# EAGLE design BUDDY_BEST (1) (EAGLE 9.6.2)
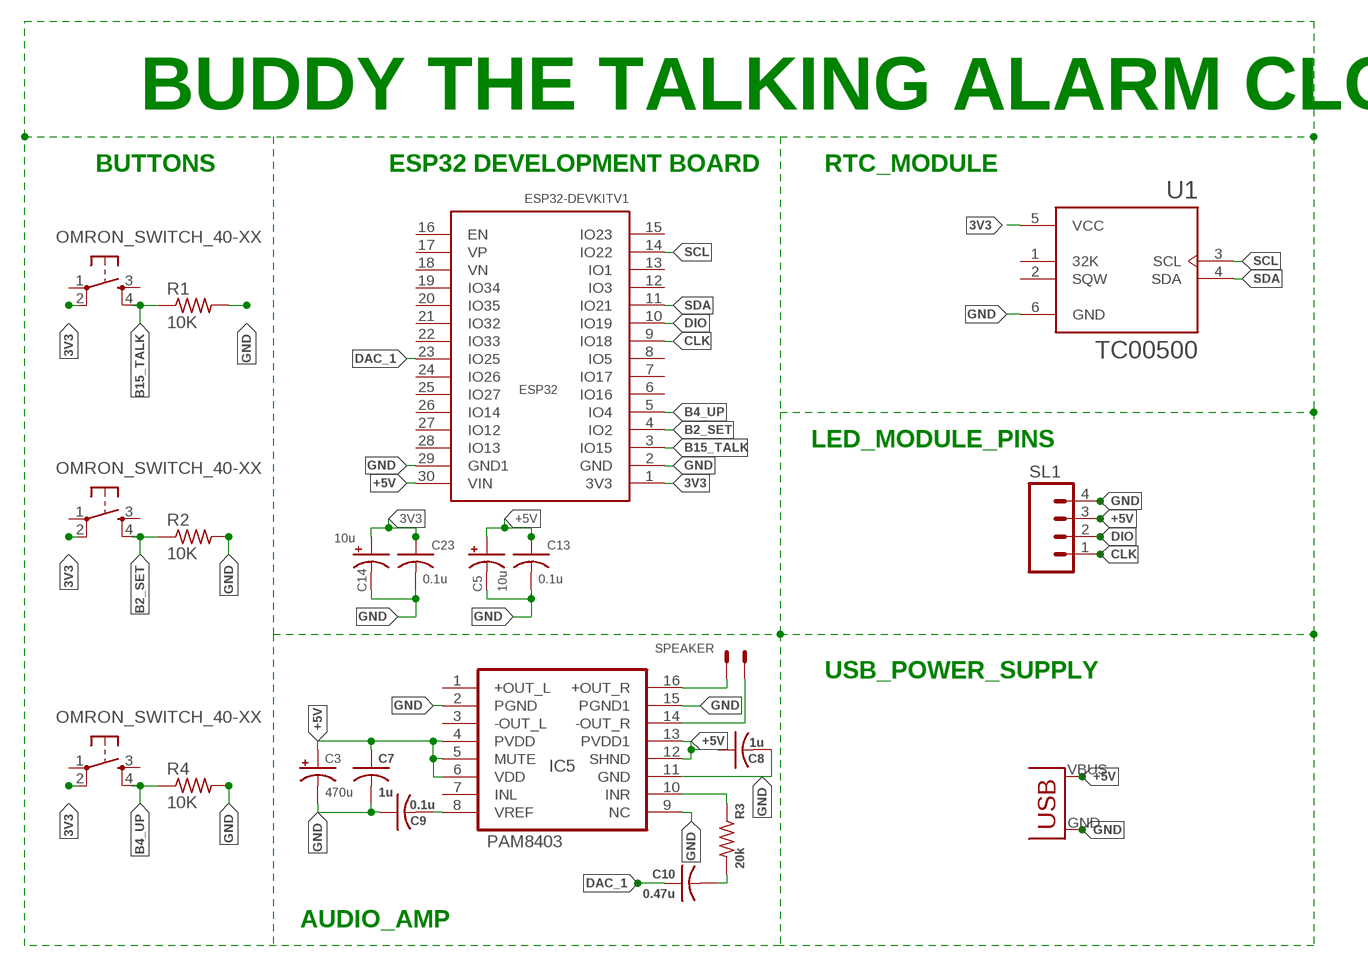
[diagram p0: schematic, sheet 1]

## Parts
C3  470u  CPOL-USE5-10.5  [E5-10,5]
C5  10u  CPOL-USE2.5-5  [E2,5-5]
C7  1u  CAP0805  [C0805]
C8  1u  CAP0805  [C0805]
C9  0.1u  CAP0805  [C0805]
C10  0.47u  CAP0603  [C0603]
C13  0.1u  C-US025-024X044  [C025-024X044]
C14  10u  CPOL-USE2.5-5  [E2,5-5]
C23  0.1u  C-US025-024X044  [C025-024X044]
ESP32  ESP32-DEVKITV1_ESP32DEVKITV1ESP32  [ESP32]
IC5  PAM8403  [SOP-16]
R1  10K  RESISTOR0207/10  [0207/10]
R2  10K  RESISTOR0207/10  [0207/10]
R3  20k  R-US_0207/10  [0207/10]
R4  10K  RESISTOR0207/10  [0207/10]
SL1  M04  [04P]
SPEAKER  SPEAKER  JST-XH-02-PIN-LONG-PAD  [JST-XH-02-PACKAGE-LONG-PAD]
U1  TC00500  [MODULE_TC00500]
U$1  OMRON_SWITCH_40-XX  [B3F-40XX]
U$2  OMRON_SWITCH_40-XX  [B3F-40XX]
U$3  OMRON_SWITCH_40-XX  [B3F-40XX]
U$5  USB(POWER)  [USB(POWER)]

## Nets
3V3: C14.+ C23.1 ESP32.1(3V3) U1.5(VCC) U$1.2(P1) U$2.2(P1) U$3.2(P1)
+5V [POWER]: C3.+ C5.+ C7.1 C8.1 C13.1 ESP32.30(VIN) IC5.4(PVDD) IC5.5(MUTE) IC5.6(VDD) IC5.12(SHND) IC5.13(PVDD1) SL1.3 U$5.VBUS(VCC)
B2_SET: ESP32.4(IO2) R2.1 U$1.4(S1)
B4_UP: ESP32.5(IO4) R4.1 U$3.4(S1)
B15_TALK: ESP32.3(IO15) R1.1 U$2.4(S1)
CLK: ESP32.9(IO18) SL1.1
DAC_1: C10.1 ESP32.23(IO25)
DIO: ESP32.10(IO19) SL1.2
GND: C3.- C5.- C7.2 C8.2 C9.1 C13.2 C14.- C23.2 ESP32.2(GND) ESP32.29(GND1) IC5.2(PGND) IC5.9(NC) IC5.11(GND) IC5.15(PGND1) R1.2 R2.2 R4.2 SL1.4 U1.6(GND) U$5.GND
N$1: IC5.16(+OUT_R) SPEAKER.2
N$5: IC5.14(-OUT_R) SPEAKER.1
N$7: C9.2 IC5.8(VREF)
N$8: C10.2 R3.2
N$29: IC5.10(INR) R3.1
SCL: ESP32.14(IO22) U1.3(SCL)
SDA: ESP32.11(IO21) U1.4(SDA)
Unconnected: ESP32.6(IO16) ESP32.7(IO17) ESP32.8(IO5) ESP32.12(IO3) ESP32.13(IO1) ESP32.15(IO23) ESP32.16(EN) ESP32.17(VP) ESP32.18(VN) ESP32.19(IO34) ESP32.20(IO35) ESP32.21(IO32) ESP32.22(IO33) ESP32.24(IO26) ESP32.25(IO27) ESP32.26(IO14) ESP32.27(IO12) ESP32.28(IO13) IC5.1(+OUT_L) IC5.3(-OUT_L) IC5.7(INL) U1.1(32K) U1.2(SQW) U$1.1(P) U$1.3(S) U$2.1(P) U$2.3(S) U$3.1(P) U$3.3(S)

## Notes on the sheet
- BUDDY THE TALKING ALARM CLOCK
- BUTTONS | ESP32 DEVELOPMENT BOARD | RTC_MODULE
- LED_MODULE_PINS
- USB_POWER_SUPPLY
- AUDIO_AMP

## Library data of the parts
C3 C5 C14 = rcl:CPOL-US: POLARIZED CAPACITOR, American symbol; SPICEPREFIX: C
C7-C10 = CEDT_JANUARY_2015_v5:CAP
C13 C23 = adafruit:C-US: CAPACITOR, American symbol
ESP32 = tw_ind:ESP32-DEVKITV1_ESP32DEVKITV1
IC5 = PAM8403:PAM8403: Dual channel audio amplifier IC - PAM8403
R1 R2 R4 = CEDT_2022_v1:RESISTOR
R3 = rcl:R-US_: RESISTOR, American symbol; SPICEPREFIX: R
SL1 = con-amp-quick:M04: AMP QUICK CONNECTOR; OC_FARNELL: unknown; OC_NEWARK: unknown
SPEAKER = Rembrandt Electronics - JST XH Connectors v1-0:JST-XH-02-PIN: JST XH Connector 2 Pin Wire to board connector. Pitch: 2,54 mm, (0.100") Number of pins: 2 Created by Rembrandt Electronics www.rembrandtelectronics.com
U1 = TC00500:TC00500: DS3231 AT24C32 IIC module precision Real time clock quare memory for Arduino Check availability <https://pricing.snapeda.com/parts/TC00500/YKS/view-part?ref=eda>; AVAILABILITY: Not in stock; DESCRIPTION: DS3231 AT24C32 IIC module precision Real time clock quare memory for Arduino; MF: YKS; MP: TC00500; PACKAGE: None; PRICE: None
U$1-U$3 = CEDT_2022_v1:OMRON_SWITCH
U$5 = CEDT_2022_v1:USB(POWER)

## Net classes
0 default: width 0.508 mm
1 POWER: width 0.711 mm, drill 0.7 mm, clearance 0.25 mm

## Board
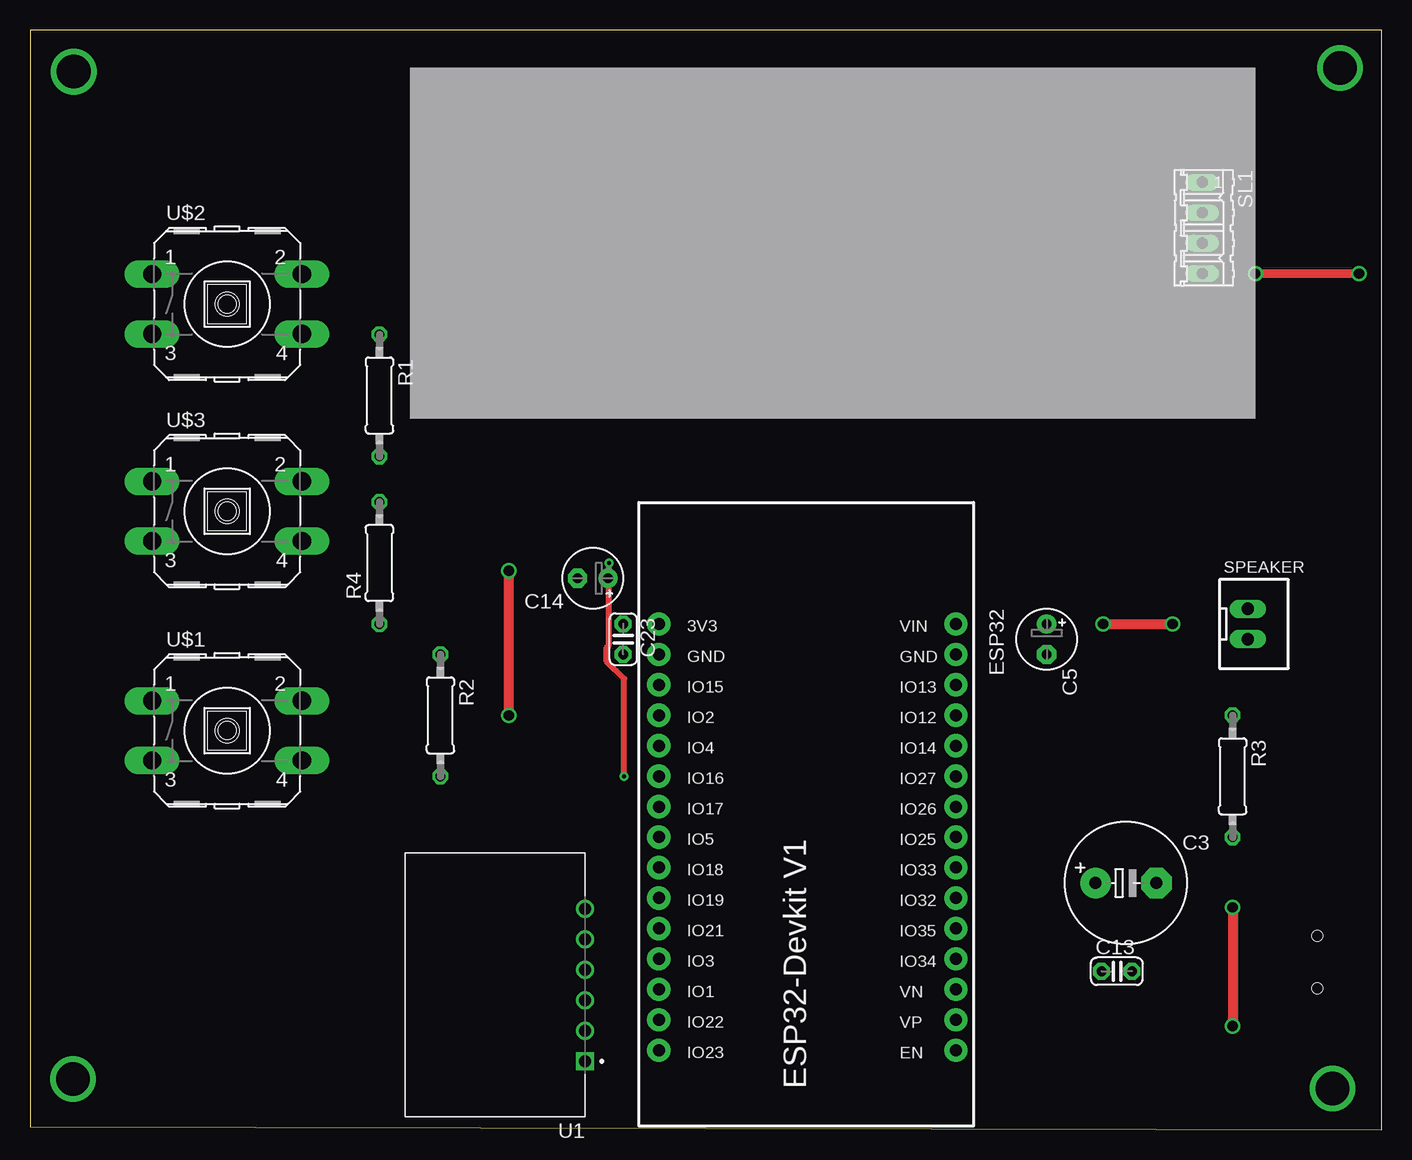
[diagram p1: board, top side]
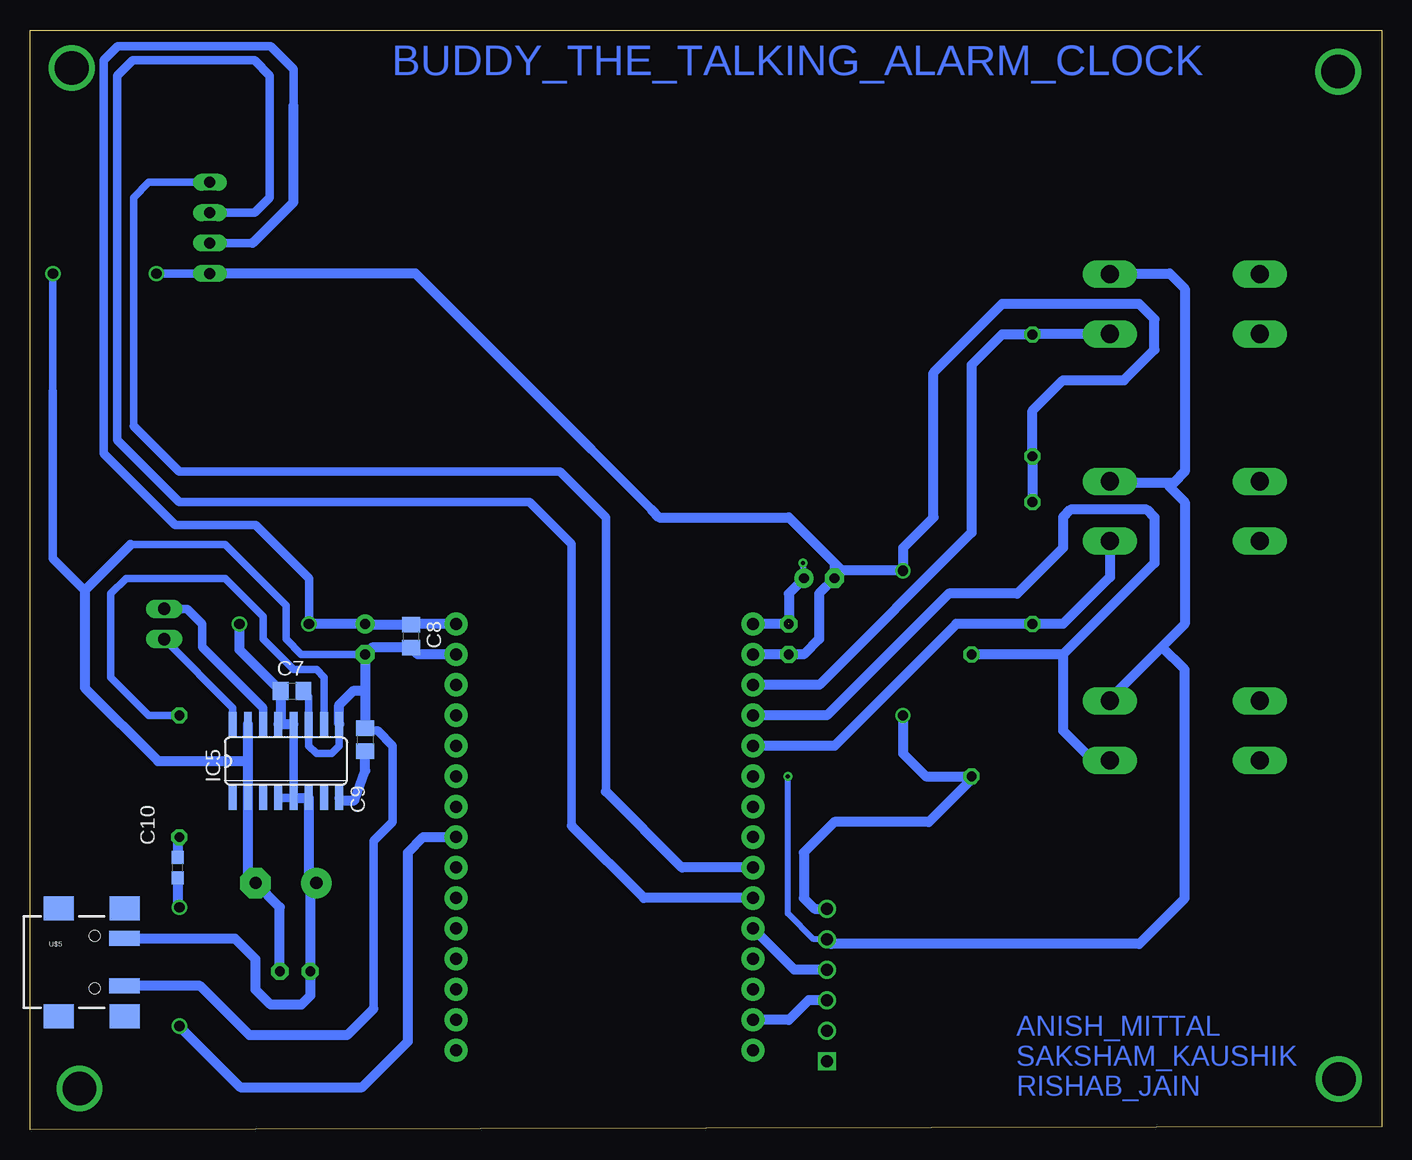
[diagram p2: board, bottom side, seen from below]

Size 112.7 x 91.68 mm. Coordinates in mm from the lower left corner, seen from the top.
Outline: 0,0.25 112.7,0 112.7,91.68 0,91.68 0,0.25
Copper layers (1*16): Top 0.035mm / dielectric 1.5mm / Bottom 0.035mm
Design rules "default *": minimum track width 6mil, minimum drill 0.35mm, track to track 16mil, track to pad 16mil, pad to pad 16mil, via to via 16mil, smd to smd 16mil, copper to edge 40mil, drill to drill 6mil, minimum pad ring 10mil, minimum via ring 8mil, stop-mask expansion 4mil, vias tented up to drill 0mil, thermal gap 10mil

### Footprints (pad centres in the part's own frame; a part is rotated, then mirrored left to right if it is on the bottom)
E5-10,5 = drill 1.016 pad 2.54: + -2.54,0 | drill 1.016 pad 2.54 octagon: - 2.54,0
E2,5-5 = drill 0.813 pad 1.6: + -1.27,0 | drill 0.813 pad 1.6 octagon: - 1.27,0
C0805 = smd 1.3 x 1.5: 1 -0.95,0; 2 0.95,0
C0603 = smd 1.1 x 1: 1 -0.85,0; 2 0.85,0
C025-024X044 = drill 0.813 pad 1.422 octagon: 1 -1.27,0; 2 1.27,0
ESP32 = drill 1 pad 1.93: 1 -15.25,-13.54; 2 -12.71,-13.54; 3 -10.17,-13.54; 4 -7.63,-13.54; 5 -5.09,-13.54; 6 -2.55,-13.54; 7 -0.01,-13.54; 8 2.53,-13.54; 9 5.07,-13.54; 10 7.61,-13.54; 11 10.15,-13.54; 12 12.69,-13.54; 13 15.23,-13.54; 14 17.77,-13.54; 15 20.31,-13.54; 16 20.31,11.23; 17 17.77,11.23; 18 15.23,11.23; 19 12.69,11.23; 20 10.15,11.23; 21 7.61,11.23; 22 5.07,11.23; 23 2.53,11.23; 24 -0.01,11.23; 25 -2.55,11.23; 26 -5.09,11.23; 27 -7.63,11.23; 28 -10.17,11.23; 29 -12.71,11.23; 30 -15.25,11.23
SOP-16 = smd 0.66 x 2.032: 1 -4.445,-3.073; 2 -3.175,-3.073; 3 -1.905,-3.073; 4 -0.635,-3.073; 5 0.635,-3.073; 6 1.905,-3.073; 7 3.175,-3.073; 8 4.445,-3.073; 9 4.445,3.073; 10 3.175,3.073; 11 1.905,3.073; 12 0.635,3.073; 13 -0.635,3.073; 14 -1.905,3.073; 15 -3.175,3.073; 16 -4.445,3.073
0207/10 = drill 0.813 octagon: 1 -5.08,0; 2 5.08,0
04P = drill 0.914 long: 1 -3.81,0; 2 -1.27,0; 3 1.27,0; 4 3.81,0
JST-XH-02-PACKAGE-LONG-PAD = drill 1.016 long: 1 -1.27,0; 2 1.27,0
MODULE_TC00500 = drill 1 square: 1 0,6.35 | drill 1: 2 0,3.81; 3 0,1.27; 4 0,-1.27; 5 0,-3.81; 6 0,-6.35
B3F-40XX = drill 1.524 long: 1 -6.248,2.489; 2 6.248,2.489; 3 -6.248,-2.489; 4 6.248,-2.489
USB(POWER) = smd 2.54 x 1.27: GND 2.5,-1.981; VBUS 2.5,1.981 | smd 2.5 x 2: GND@1 -3,-4.5; GND@2 -3,4.5; GND@3 2.5,4.5; GND@4 2.5,-4.5 | hole 0.9: 0,2.2; 0,-2.2

### Placement (x,y rotation side)
C3  91.36,20.57 0 top
C5  84.76,40.89 270 top
C7  90.85,36.58 0 bottom
C8  80.95,41.15 270 bottom
C9  84.76,32.51 270 bottom
C10  100.38,21.84 90 bottom
C13  90.6,13.21 0 top
C14  46.91,45.97 180 top
C23  49.45,40.89 270 top
ESP32  65.96,26.92 270 top
IC5  91.36,30.73 0 bottom
R1  29.13,61.21 270 top
R2  34.21,34.54 270 top
R3  100.25,29.46 270 top
R4  29.13,47.24 90 top
SL1  97.71,75.18 270 top
SPEAKER  101.52,42.16 270 top
U1  46.27,12.06 180 top
U$1  16.43,33.27 0 top
U$2  16.43,68.83 0 top
U$3  16.43,51.56 0 top
U$5  107.31,13.97 0 bottom

### Tracks (layer width: path | path; a pad name or v marks a point on that pad's centre or on a via)
3V3  (via drill 0.35)  (1 unrouted)
  Top 0.508: v49.53,29.46 49.53,37.6 48.08,39.06 48.08,40.19 48.26,40.37 v48.26,47.24
  Bottom 0.508: U1.5 47.37,15.88 49.53,18.03 v49.53,29.46 | v48.26,47.24 48.26,46.05 C14.+
  Bottom 0.813: U$2.2 22.63,71.37 17.7,71.37 16.43,70.1 16.43,54.86 17.32,53.97 | 17.32,53.97 17.7,53.59 16.43,52.32 16.43,42.16 18.34,40.26 | U$3.2 22.6,53.97 17.32,53.97 | 18.34,40.26 22.83,35.76 U$1.2 | U1.5 45.89,15.49 20.24,15.49 16.43,19.3 16.43,38.35 18.34,40.26 | C23.1 49.45,44.7 C14.+ | C23.1 ESP32.1
+5V  (via drill 0.85)
  Top 0.813: v89.45,42.16 v95.25,42.16
  Bottom 0.711: IC5.12 IC5.5 IC5.4 | 94.15,73.91 SL1.3 | 90.72,85.34 90.72,88.41 92.63,90.31 105.39,90.31 106.55,89.15 106.55,76.06 106.55,56.38 100.59,50.42 93.9,50.42 89.44,45.95 89.44,42.16
  Bottom 0.813: v89.45,42.16 v89.44,42.17 89.44,42.16 C5.+ 84.69,42.1 C8.1 80.87,42.17 ESP32.30 | v95.25,42.16 95.25,40.02 C7.1 91.8,34 | 94.15,73.91 90.72,77.34 90.72,85.34 | IC5.5 IC5.6 89.45,21.21 C3.+ 89.33,20.07 C13.1 89.33,11.18 90.09,10.41 92.63,10.41 93.9,11.68 93.9,14.22 95.63,15.95 U$5.VBUS | 91.8,34 IC5.13 | IC5.12 91.61,33.81 91.8,34
B2_SET
  Bottom 0.813: 26.59,39.62 R2.1 | ESP32.4 46.27,34.54 36.12,44.7 30.4,44.7 26.59,48.51 26.59,51.05 25.95,51.69 19.61,51.69 18.97,51.05 18.97,47.24 26.59,39.62 | 26.59,39.62 26.59,33.27 24.1,30.79 U$1.4
B4_UP
  Bottom 0.813: U$3.4 22.68,46.08 26.59,42.16 R4.1 35.48,42.16 45.63,32.01 ESP32.5
B15_TALK
  Bottom 0.813: U$2.4 29.08,66.34 R1.1 31.67,66.29 34.21,63.75 34.21,49.78 46.9,37.09 ESP32.3
CLK
  Bottom 0.61: SL1.1 102.79,78.99 104.06,77.72 104.06,58.67
  Bottom 0.711: 104.06,58.67 100.25,54.86 68.5,54.86 64.69,51.05 64.69,28.19
  Bottom 0.813: ESP32.9 58.33,21.85 58.34,21.84 64.69,28.19
DAC_1  (via drill 0.85)
  Top 0.813: v100.25,18.54 v100.25,8.64
  Bottom 0.813: C10.1 100.38,18.67 v100.25,18.54 | v100.25,8.64 95.17,3.56 85.01,3.56 81.2,7.37 81.2,23.11 79.92,24.39 ESP32.23
DIO
  Bottom 0.711: 67.55,25.34 67.55,48.83 71.04,52.32 100.25,52.32 105.41,57.48 105.41,87.88 104.14,89.15 93.98,89.15 92.71,87.88 92.71,77.72 93.98,76.45 SL1.2
  Bottom 0.813: ESP32.10 61.52,19.31 67.55,25.34
GND  (via drill 0.85)
  Top 0.711: v102.16,71.37 v110.79,71.37
  Top 0.813: v39.92,34.54 v39.92,46.61
  Bottom 0.61: 104.31,48.77 96.44,48.77 91.36,43.69 91.36,40.89 90.09,39.62 C5.- | IC5.9 86.92,32 87.55,31.37 88.82,31.37 89.45,32 IC5.11 89.45,36.13 C7.2 | v110.79,71.37 110.79,61.59
  Bottom 0.711: C9.1 84.57,33.27 83.74,33.27 82.47,32 82.47,25.65 84.06,24.07 84.06,10.1 | SL1.4 v102.16,71.37 | 110.79,61.59 110.79,47.62 108.12,44.96 | 60.88,51.69 65.96,56.77
  Bottom 0.813: R4.2 R1.2 29.13,59.94 26.59,62.48 21.51,62.48 18.97,65.02 18.97,67.56 20.24,68.83 31.67,68.83 37.38,63.12 37.38,51.05 39.92,48.51 v39.92,46.61 45.01,46.61 | IC5.15 94.53,30.73 | 94.53,30.73 IC5.2 94.53,21.21 C3.- 91.87,18.54 C13.2 | 97.52,71.18 SL1.4 80.56,71.37 65.96,56.77 | 94.53,30.73 102.03,30.73 108.12,36.83 108.12,44.96 104.31,48.77 | 84.76,36.83 C5.- 84.18,40.2 C8.2 80.38,39.63 ESP32.29 | 84.76,36.83 85.01,36.58 85.77,36.58 86.92,35.43 IC5.9 | 84.76,36.83 C9.1 | 84.06,10.1 86.28,7.87 94.41,7.87 98.52,11.99 U$5.GND | C14.- 46.91,44.7 46.91,40.89 48.18,39.62 C23.2 ESP32.2 | 45.01,46.61 C14.- | 60.88,51.69 60.24,51.05 49.45,51.05 45.64,47.24 | 45.64,47.24 C14.- | v39.92,34.54 39.92,31.37 38.02,29.46 R2.2 34.21,29.21 37.77,25.65 45.64,25.65 48.18,23.11 48.18,19.3 47.29,18.42 U1.6 | 45.64,47.24 45.01,46.61
N$1
  Bottom 0.61: SPEAKER.2 95.81,35.18 IC5.16
N$2  (via drill 2.79 pad 3.81)
  other vias: 3.65,88.21
N$3  (via drill 2.79 pad 3.81)
  other vias: 3.59,4.22
N$5
  Bottom 0.711: SPEAKER.1 99.61,43.43 98.34,42.16 98.34,40.26 93.27,35.18 IC5.14
N$7
  Bottom 0.813: IC5.8 86.72,27.46 85.64,27.46 84.76,29.92 C9.2
N$8
  Bottom 0.813: R3.2 100.38,24.26 C10.2
N$9  (via drill 2.79 pad 3.81)
  other vias: 108.58,3.43
N$10  (via drill 2.79 pad 3.81)
  other vias: 109.22,88.52
N$29
  Bottom 0.61: IC5.10 88.19,37.72 88.82,38.35 90.72,38.35 93.27,40.89 93.27,42.8 96.44,45.97 104.69,45.97 105.97,44.7 105.97,37.72 102.79,34.54 R3.1
SCL
  Bottom 0.813: U1.3 47.8,10.79 49.44,9.15 ESP32.14
SDA
  Bottom 0.813: U1.4 48.98,13.33 ESP32.11

### Text on the board
Bottom: BUDDY_THE_TALKING_ALARM_CLOCK | ANISH_MITTAL / SAKSHAM_KAUSHIK / RISHAB_JAIN